# EAGLE design ESPBaseboard (EAGLE 9.6.2)
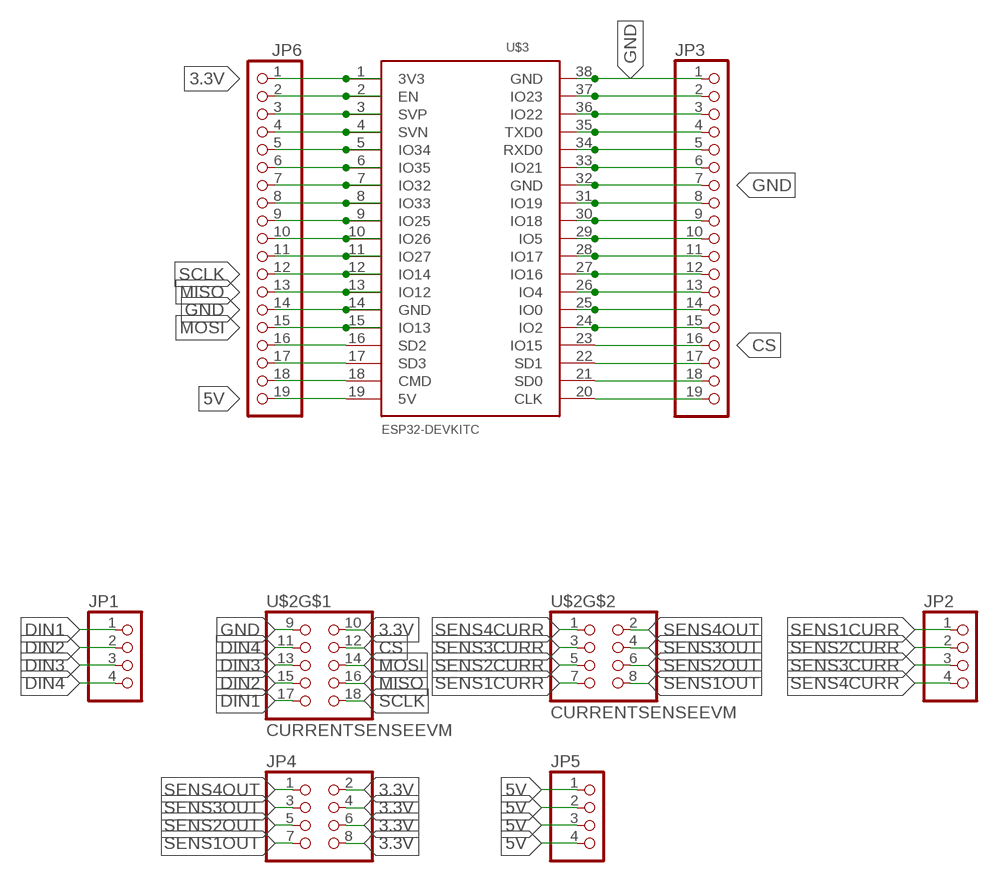
[diagram p0: schematic, sheet 1]

## Parts
JP1  PINHD-1X4  [1X04]
JP2  PINHD-1X4  [1X04]
JP3  PINHD-1X19  [1X19]
JP4  PINHD-2X4  [2X04]
JP5  PINHD-1X4  [1X04]
JP6  PINHD-1X19  [1X19]
U$2  CURRENTSENSEEVM  [CURRENTSENSEEVM]
U$3  ESP32DEVKITC  [ESP32-DEVKITC]

## Nets
3.3V: JP4.2 JP4.4 JP4.6 JP4.8 JP6.1 U$2.10 U$3.1(3V3)
5V: JP5.1 JP5.2 JP5.3 JP5.4 JP6.19 U$3.19(5V)
CS: JP3.10 JP3.16 U$2.12 U$3.23(IO15) U$3.29(IO5)
DIN1: JP1.1 U$2.17
DIN2: JP1.2 U$2.15
DIN3: JP1.3 U$2.13
DIN4: JP1.4 U$2.11
GND: JP3.1 JP3.7 JP6.14 U$2.9 U$3.14(GND) U$3.32(GND) U$3.38(GND)
MISO: JP3.8 JP6.13 U$2.16 U$3.13(IO12) U$3.31(IO19)
MOSI: JP3.2 JP6.15 U$2.14 U$3.15(IO13) U$3.37(IO23)
N$2: JP6.2 U$3.2(EN)
N$3: JP6.3 U$3.3(SVP)
N$4: JP6.4 U$3.4(SVN)
N$5: JP6.5 U$3.5(IO34)
N$7: JP6.7 U$3.7(IO32)
N$8: JP6.8 U$3.8(IO33)
N$9: JP6.9 U$3.9(IO25)
N$10: JP6.10 U$3.10(IO26)
N$11: JP6.11 U$3.11(IO27)
N$18: JP3.3 U$3.36(IO22)
N$19: JP3.4 U$3.35(TXD0)
N$20: JP3.5 U$3.34(RXD0)
N$21: JP3.6 U$3.33(IO21)
N$26: JP3.11 U$3.28(IO17)
N$27: JP3.12 U$3.27(IO16)
N$28: JP3.13 U$3.26(IO4)
N$29: JP3.14 U$3.25(IO0)
N$30: JP3.15 U$3.24(IO2)
N$31: JP6.16 U$3.16(SD2)
N$32: JP6.17 U$3.17(SD3)
N$33: JP6.18 U$3.18(CMD)
N$35: JP3.19 U$3.20(CLK)
N$36: JP3.18 U$3.21(SD0)
N$37: JP3.17 U$3.22(SD1)
SCLK: JP3.9 JP6.6 JP6.12 U$2.18 U$3.6(IO35) U$3.12(IO14) U$3.30(IO18)
SENS1CURR: JP2.1 U$2.7
SENS1OUT: JP4.7 U$2.8
SENS2CURR: JP2.2 U$2.5
SENS2OUT: JP4.5 U$2.6
SENS3CURR: JP2.3 U$2.3
SENS3OUT: JP4.3 U$2.4
SENS4CURR: JP2.4 U$2.1
SENS4OUT: JP4.1 U$2.2

## Library data of the parts
JP1 JP2 JP5 = pinhead-currentsense:PINHD-1X4: PIN HEADER
JP3 JP6 = pinhead:PINHD-1X19: PIN HEADER
JP4 = pinhead-currentsense:PINHD-2X4: PIN HEADER
U$2 = pinhead-currentsense:CURRENTSENSEEVM
U$3 = ESP32-DEVKITC:ESP32DEVKITC

## Board
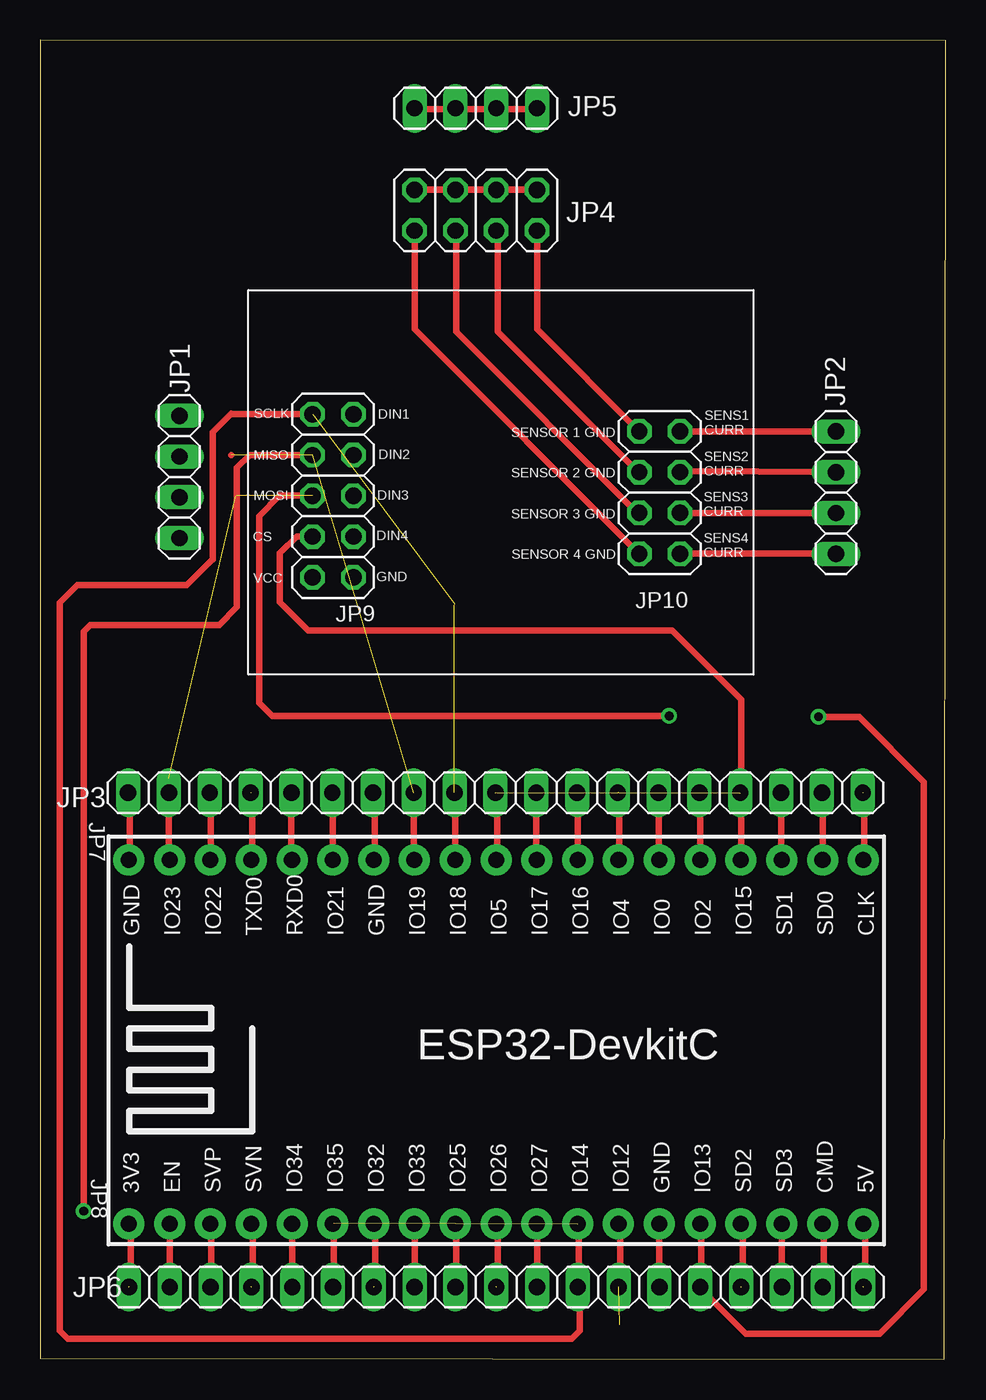
[diagram p1: board, top side]
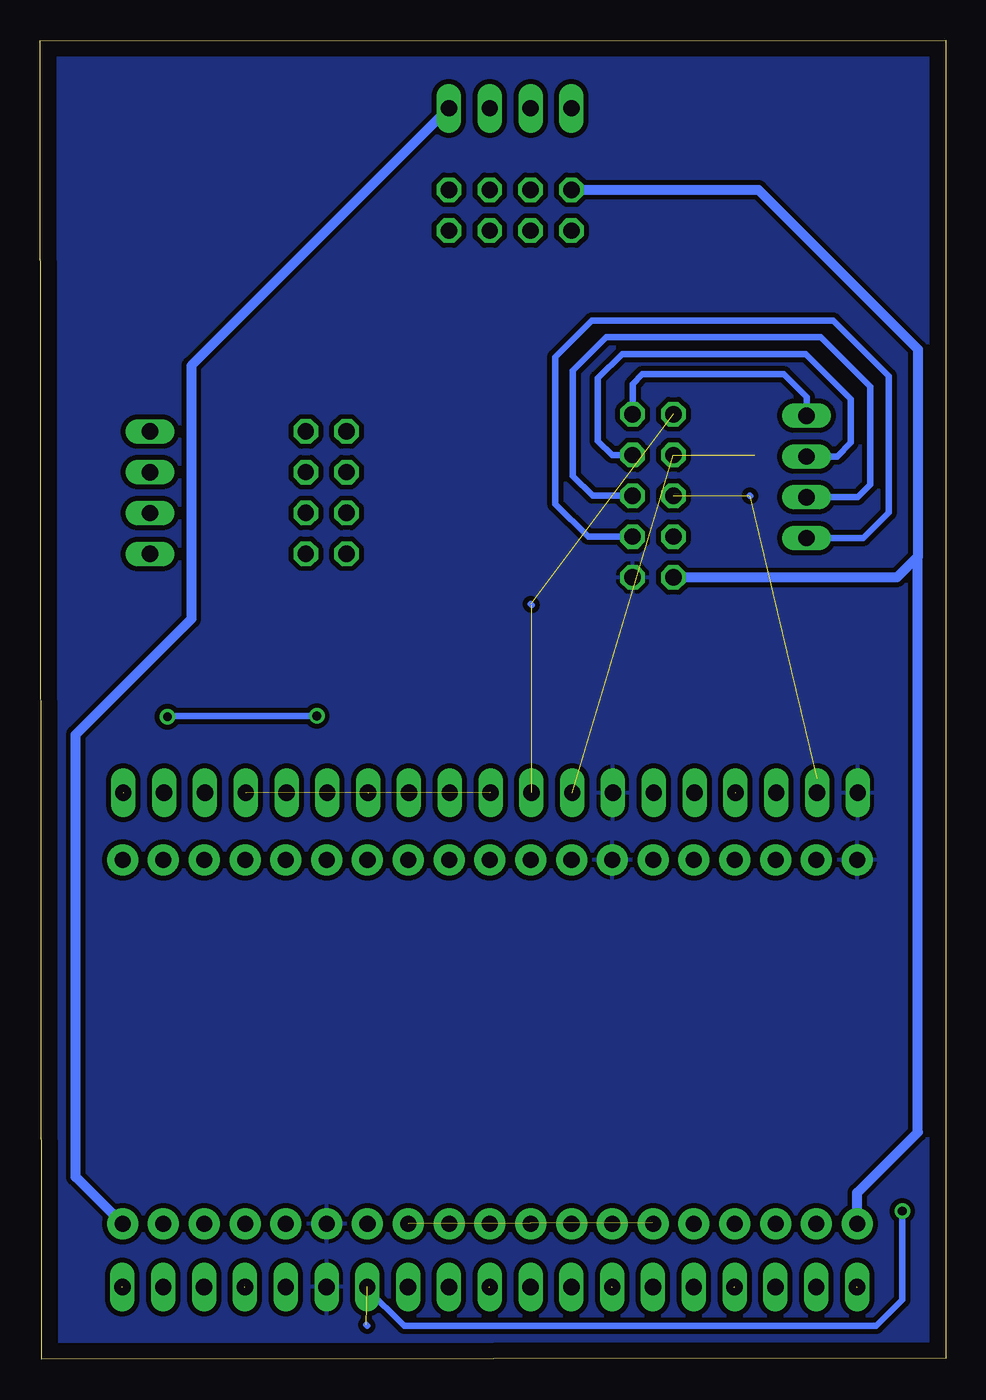
[diagram p2: board, bottom side, seen from below]

Size 56.37 x 82.14 mm. Coordinates in mm from the lower left corner, seen from the top.
Outline: 0,0.08 56.27,0 56.37,82.11 0,82.14 0,0.08
Copper layers (1*16): Top 0.035mm / dielectric 1.5mm / Bottom 0.035mm
Design rules "default": minimum track width 6mil, minimum drill 0.35mm, track to track 6mil, track to pad 6mil, pad to pad 6mil, via to via 6mil, smd to smd 6mil, copper to edge 40mil, drill to drill 6mil, minimum pad ring 10mil, minimum via ring 8mil, stop-mask expansion 4mil, vias tented up to drill 0mil, thermal gap 10mil

### Footprints (pad centres in the part's own frame; a part is rotated, then mirrored left to right if it is on the bottom)
1X04 = drill 1.016 long: 1 -3.81,0; 2 -1.27,0; 3 1.27,0; 4 3.81,0
1X19 = drill 1.016 long: 1 -22.86,0; 2 -20.32,0; 3 -17.78,0; 4 -15.24,0; 5 -12.7,0; 6 -10.16,0; 7 -7.62,0; 8 -5.08,0; 9 -2.54,0; 10 0,0; 11 2.54,0; 12 5.08,0; 13 7.62,0; 14 10.16,0; 15 12.7,0; 16 15.24,0; 17 17.78,0; 18 20.32,0; 19 22.86,0
2X04 = drill 1.016 octagon: 1 -3.81,-1.27; 2 -3.81,1.27; 3 -1.27,-1.27; 4 -1.27,1.27; 5 1.27,-1.27; 6 1.27,1.27; 7 3.81,-1.27; 8 3.81,1.27
CURRENTSENSEEVM = drill 1.016 octagon: 1 24.147,2.742; 2 21.607,2.742; 3 24.147,5.282; 4 21.607,5.282; 5 24.147,7.822; 6 21.607,7.822; 7 24.147,10.362; 8 21.607,10.362; 9 3.81,1.27; 10 1.27,1.27; 11 3.81,3.81; 12 1.27,3.81; 13 3.81,6.35; 14 1.27,6.35; 15 3.81,8.89; 16 1.27,8.89; 17 3.81,11.43; 18 1.27,11.43
ESP32-DEVKITC = drill 1 pad 1.93: 1 -22.87,-11.42; 2 -20.33,-11.42; 3 -17.79,-11.42; 4 -15.25,-11.42; 5 -12.71,-11.42; 6 -10.17,-11.42; 7 -7.63,-11.42; 8 -5.09,-11.42; 9 -2.55,-11.42; 10 -0.01,-11.42; 11 2.53,-11.42; 12 5.07,-11.42; 13 7.61,-11.42; 14 10.15,-11.42; 15 12.69,-11.42; 16 15.23,-11.42; 17 17.77,-11.42; 18 20.31,-11.42; 19 22.85,-11.42; 20 22.85,11.23; 21 20.31,11.23; 22 17.77,11.23; 23 15.23,11.23; 24 12.69,11.23; 25 10.15,11.23; 26 7.61,11.23; 27 5.07,11.23; 28 2.53,11.23; 29 -0.01,11.23; 30 -2.55,11.23; 31 -5.09,11.23; 32 -7.63,11.23; 33 -10.17,11.23; 34 -12.71,11.23; 35 -15.25,11.23; 36 -17.79,11.23; 37 -20.33,11.23; 38 -22.87,11.23

### Placement (x,y rotation side)
JP1  8.66,54.94 270 top
JP2  49.54,53.96 270 top
JP3  28.33,35.28 0 top
JP4  27.12,71.55 0 top
JP5  27.12,77.9 0 top
JP6  28.39,4.5 0 top
U$2  15.69,47.42 0 top
U$3  28.39,19.86 0 top

### Tracks (layer width: path | path; a pad name or v marks a point on that pad's centre or on a via)
3.3V  (1 unrouted)
  Top 0.152: 5.63,4.55 5.54,4.48 | 5.63,8.35 U$3.1
  Top 0.406: 5.63,8.35 5.63,4.55 | JP4.8 JP4.6 JP4.4 JP4.2
  Bottom 0.61: JP4.2 11.66,72.82 1.75,62.9 1.75,49.98 | 1.75,49.98 3.04,48.69 U$2.10 | U$3.1 5.52,10.37 1.75,14.14 1.75,49.98
5V  (1 unrouted)
  Top 0.152: 51.35,4.55 51.26,4.48 | 51.35,8.35 U$3.19 | 23.31,77.85 JP5.1 | 25.74,77.85 JP5.2 25.9,77.85 | 28.49,77.85 JP5.3 28.33,77.85 | 30.93,77.85 JP5.4
  Top 0.406: 51.35,8.35 51.35,4.55 | 25.74,77.85 23.31,77.85 | 30.93,77.85 28.49,77.85 | 28.33,77.85 25.9,77.85
  Bottom 0.61: JP5.4 46.96,61.87 46.96,46.1 54.16,38.9 54.16,11.36 U$3.19
CS  (3 unrouted)
  Top 0.152: 28.44,35.23 28.35,35.29 | 28.44,31.16 U$3.29 | 43.63,35.19 43.55,35.25 | 43.63,31.11 U$3.23
  Top 0.406: 28.44,31.16 28.44,35.23 | U$2.12 15.96,51.23 14.92,50.19 14.92,47.15 16.69,45.38 39.35,45.38 43.63,41.09 43.63,35.19 43.63,31.11
DIN1
  Bottom 0.406: U$2.17 19.5,60.72 18.89,61.33 10.08,61.33 8.66,59.92 JP1.1
DIN2
  Bottom 0.406: JP1.2 6.77,56.21 5.91,57.07 5.91,59.79 8.72,62.6 20.15,62.6 21.65,61.1 21.65,57.19 20.77,56.31 U$2.15
DIN3
  Bottom 0.406: U$2.13 21.99,53.77 23.23,55.01 23.23,61.55 21.13,63.65 7.78,63.65 4.69,60.56 4.69,54.47 5.49,53.67 JP1.3
DIN4
  Bottom 0.406: JP1.4 5.14,51.13 3.54,52.73 3.54,61.22 7,64.69 22.02,64.69 24.3,62.41 24.3,53.26 22.26,51.23 U$2.11
GND
  Top 0.152: 5.58,35.23 5.49,35.29 | 5.58,31.16 U$3.38 | 38.55,8.35 U$3.14 | 20.82,35.23 20.73,35.29 | 20.82,31.16 U$3.32
  Top 0.406: 5.58,31.16 5.58,35.23 | 38.55,8.35 JP6.14 | 20.82,31.16 20.82,35.23
  pour Bottom (isolate 0.305): -0.39,82.05 0.16,0.06 56.15,0.63 56.32,82.05
MISO  (via drill 0.55)  (4 unrouted)
  Top 0.152: 36.11,4.55 36.02,4.48 | 36.11,8.35 U$3.13
  Top 0.406: U$3.31 23.25,31.13 JP3.8 | 36.11,8.35 36.11,4.55 | 11.9,56.31 | v2.71,9.23 2.71,45.31 3.11,45.72 11.14,45.72 12.25,46.83 12.25,55.53 13.03,56.31 U$2.16
  Bottom 0.406: v2.71,9.23 2.71,3.7 4.32,2.09 33.72,2.09 36.07,4.44 JP6.13 | 36.01,2.09 36.07,2.15
MOSI  (via drill 0.55)  (2 unrouted)
  Top 0.152: 41.14,4.55 JP6.15 | 41.14,8.35 U$3.15
  Top 0.406: U$3.37 8.01,31.13 JP3.2 8.01,36.17 | 41.14,8.35 41.14,4.55 | U$2.14 14.89,53.77 13.64,52.52 13.64,40.87 14.44,40.07 v39.15,40.07 | v48.44,40.01 50.97,40.01 55.01,35.96 55.01,4.36 52.24,1.59 43.91,1.59 41.09,4.42 JP6.15
  Bottom 0.406: 12.21,53.77 12.18,53.74 | v39.15,40.07 48.38,40.07 v48.44,40.01
N$2
  Top 0.152: 8.07,8.35 U$3.2
  Top 0.406: 8.07,8.35 JP6.2
N$3
  Top 0.152: 10.66,4.55 JP6.3 | 10.66,8.35 U$3.3
  Top 0.406: 10.66,8.35 10.66,4.55
N$4  (1 unrouted)
  Top 0.152: 13.25,4.55 13.16,4.48 | 13.25,8.35 U$3.4
  Top 0.406: 13.25,8.35 13.25,4.55
N$5
  Top 0.152: 15.69,8.35 U$3.5
  Top 0.406: 15.69,8.35 JP6.5
N$7  (1 unrouted)
  Top 0.152: 20.87,4.55 20.78,4.48 | 20.87,8.35 U$3.7
  Top 0.406: 20.87,8.35 20.87,4.55
N$8
  Top 0.152: 23.31,8.35 U$3.8
  Top 0.406: 23.31,8.35 JP6.8
N$9
  Top 0.152: 25.9,4.55 JP6.9 | 25.9,8.35 U$3.9
  Top 0.406: 25.9,8.35 25.9,4.55
N$10  (1 unrouted)
  Top 0.152: 28.49,4.55 28.4,4.48 | 28.49,8.35 U$3.10
  Top 0.406: 28.49,8.35 28.49,4.55
N$11
  Top 0.152: 30.93,8.35 U$3.11
  Top 0.406: 30.93,8.35 JP6.11
N$18
  Top 0.152: 10.61,35.23 JP3.3 | 10.61,31.11 U$3.36
  Top 0.406: 10.61,31.11 10.61,35.23
N$19  (1 unrouted)
  Top 0.152: 13.2,35.23 13.11,35.29 | 13.2,31.16 U$3.35
  Top 0.406: 13.2,31.16 13.2,35.23
N$20
  Top 0.406: JP3.5 15.63,31.13 U$3.34
N$21
  Top 0.152: 18.23,35.23 JP3.6 | 18.23,31.11 U$3.33
  Top 0.406: 18.23,31.11 18.23,35.23
N$26
  Top 0.406: JP3.11 30.87,31.13 U$3.28
N$27
  Top 0.152: 33.47,35.23 JP3.12 | 33.47,31.11 U$3.27
  Top 0.406: 33.47,31.11 33.47,35.23
N$28  (1 unrouted)
  Top 0.152: 36.06,35.23 35.97,35.29 | 36.06,31.16 U$3.26
  Top 0.406: 36.06,31.16 36.06,35.23
N$29
  Top 0.406: JP3.14 38.49,31.13 U$3.25
N$30
  Top 0.152: 41.09,35.23 JP3.15 | 41.09,31.11 U$3.24
  Top 0.406: 41.09,31.11 41.09,35.23
N$31  (1 unrouted)
  Top 0.152: 43.73,4.55 43.64,4.48 | 43.73,8.35 U$3.16
  Top 0.406: 43.73,8.35 43.73,4.55
N$32
  Top 0.152: 46.17,8.35 U$3.17
  Top 0.406: 46.17,8.35 JP6.17
N$33
  Top 0.152: 48.76,4.55 JP6.18 | 48.76,8.35 U$3.18
  Top 0.406: 48.76,8.35 48.76,4.55
N$35  (1 unrouted)
  Top 0.152: 51.3,35.23 51.21,35.29 | 51.3,31.16 U$3.20
  Top 0.406: 51.3,31.16 51.3,35.23
N$36
  Top 0.152: 48.71,35.23 JP3.18 | 48.71,31.11 U$3.21
  Top 0.406: 48.71,31.11 48.71,35.23
N$37
  Top 0.406: JP3.17 46.11,31.13 U$3.22
SCLK  (3 unrouted)
  Top 0.152: 18.28,4.55 JP6.6 | 18.28,8.35 U$3.6 18.28,8.5 | 25.85,35.23 JP3.9 | 25.85,31.11 U$3.30 25.74,31.06 | 33.52,4.55 JP6.12 | 33.52,8.35 U$3.12
  Top 0.406: 18.28,8.35 18.28,4.55 | 25.85,31.11 25.85,35.23 | 33.52,8.35 33.52,4.55 | JP6.12 33.52,4.55 | 33.52,4.55 33.58,4.49 33.58,1.78 33.09,1.3 1.83,1.3 1.71,1.3 1.22,1.78 1.22,47.12 2.31,48.21 9.12,48.21 10.73,49.81 | U$2.18 11.92,58.85 11.88,58.89 10.73,57.73 10.73,49.81 | 10.73,49.81 10.75,49.79
  Bottom 0.406: 25.82,47.03 25.77,46.98 | 25.77,35.31 JP3.9
SENS1CURR
  Top 0.406: U$2.7 49.53,57.78 JP2.1
SENS1OUT
  Top 0.152: 37.17,57.88 U$2.8
  Top 0.406: JP4.7 30.93,64.13 37.17,57.88
SENS2CURR
  Top 0.152: 39.92,55.29 U$2.5
  Top 0.406: JP2.2 39.92,55.29
SENS2OUT
  Top 0.152: 28.49,70.23 JP4.5 | 37.17,55.29 U$2.6
  Top 0.406: 28.49,70.23 28.49,63.98 37.17,55.29
SENS3CURR
  Top 0.406: U$2.3 JP2.3
SENS3OUT
  Top 0.152: 25.9,70.23 JP4.3 | 37.17,52.7 U$2.4
  Top 0.406: 25.9,70.23 25.9,63.98 37.17,52.7
SENS4CURR
  Top 0.406: U$2.1 49.53,50.16 JP2.4
SENS4OUT
  Top 0.152: 37.17,50.26 U$2.2
  Top 0.406: JP4.1 23.31,64.13 37.17,50.26

### Text on the board
tPlace: JP10 | JP9 | JP7 | JP8